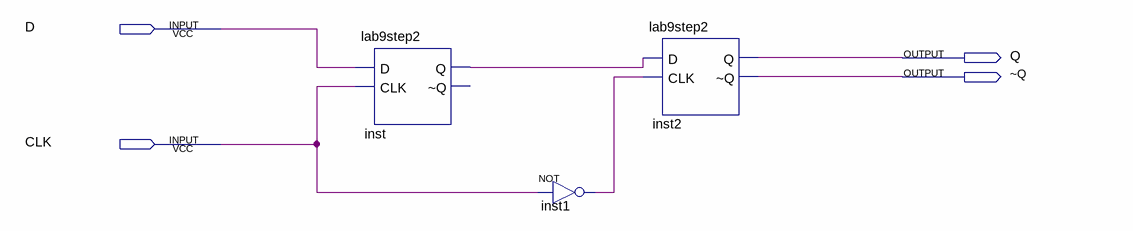
[diagram p0: schematic sheet]
// Quartus schematic Lab9step3a.bdf as structural Verilog: 3 symbols, 4 pins
module Lab9step3a (
  input  D,
  input  CLK,
  output Q,
  output \~Q 
);

  wire inst1_out, inst_q;

  lab9step2 inst (.D(D), .CLK(CLK), .Q(inst_q));  // open: ~Q
  not inst1 (inst1_out, CLK);
  lab9step2 inst2 (.D(inst_q), .CLK(inst1_out), .Q(Q), .\~Q (\~Q ));
endmodule
